# Altium project Array Supervisor Board.PrjPcb (part 3 of 3)
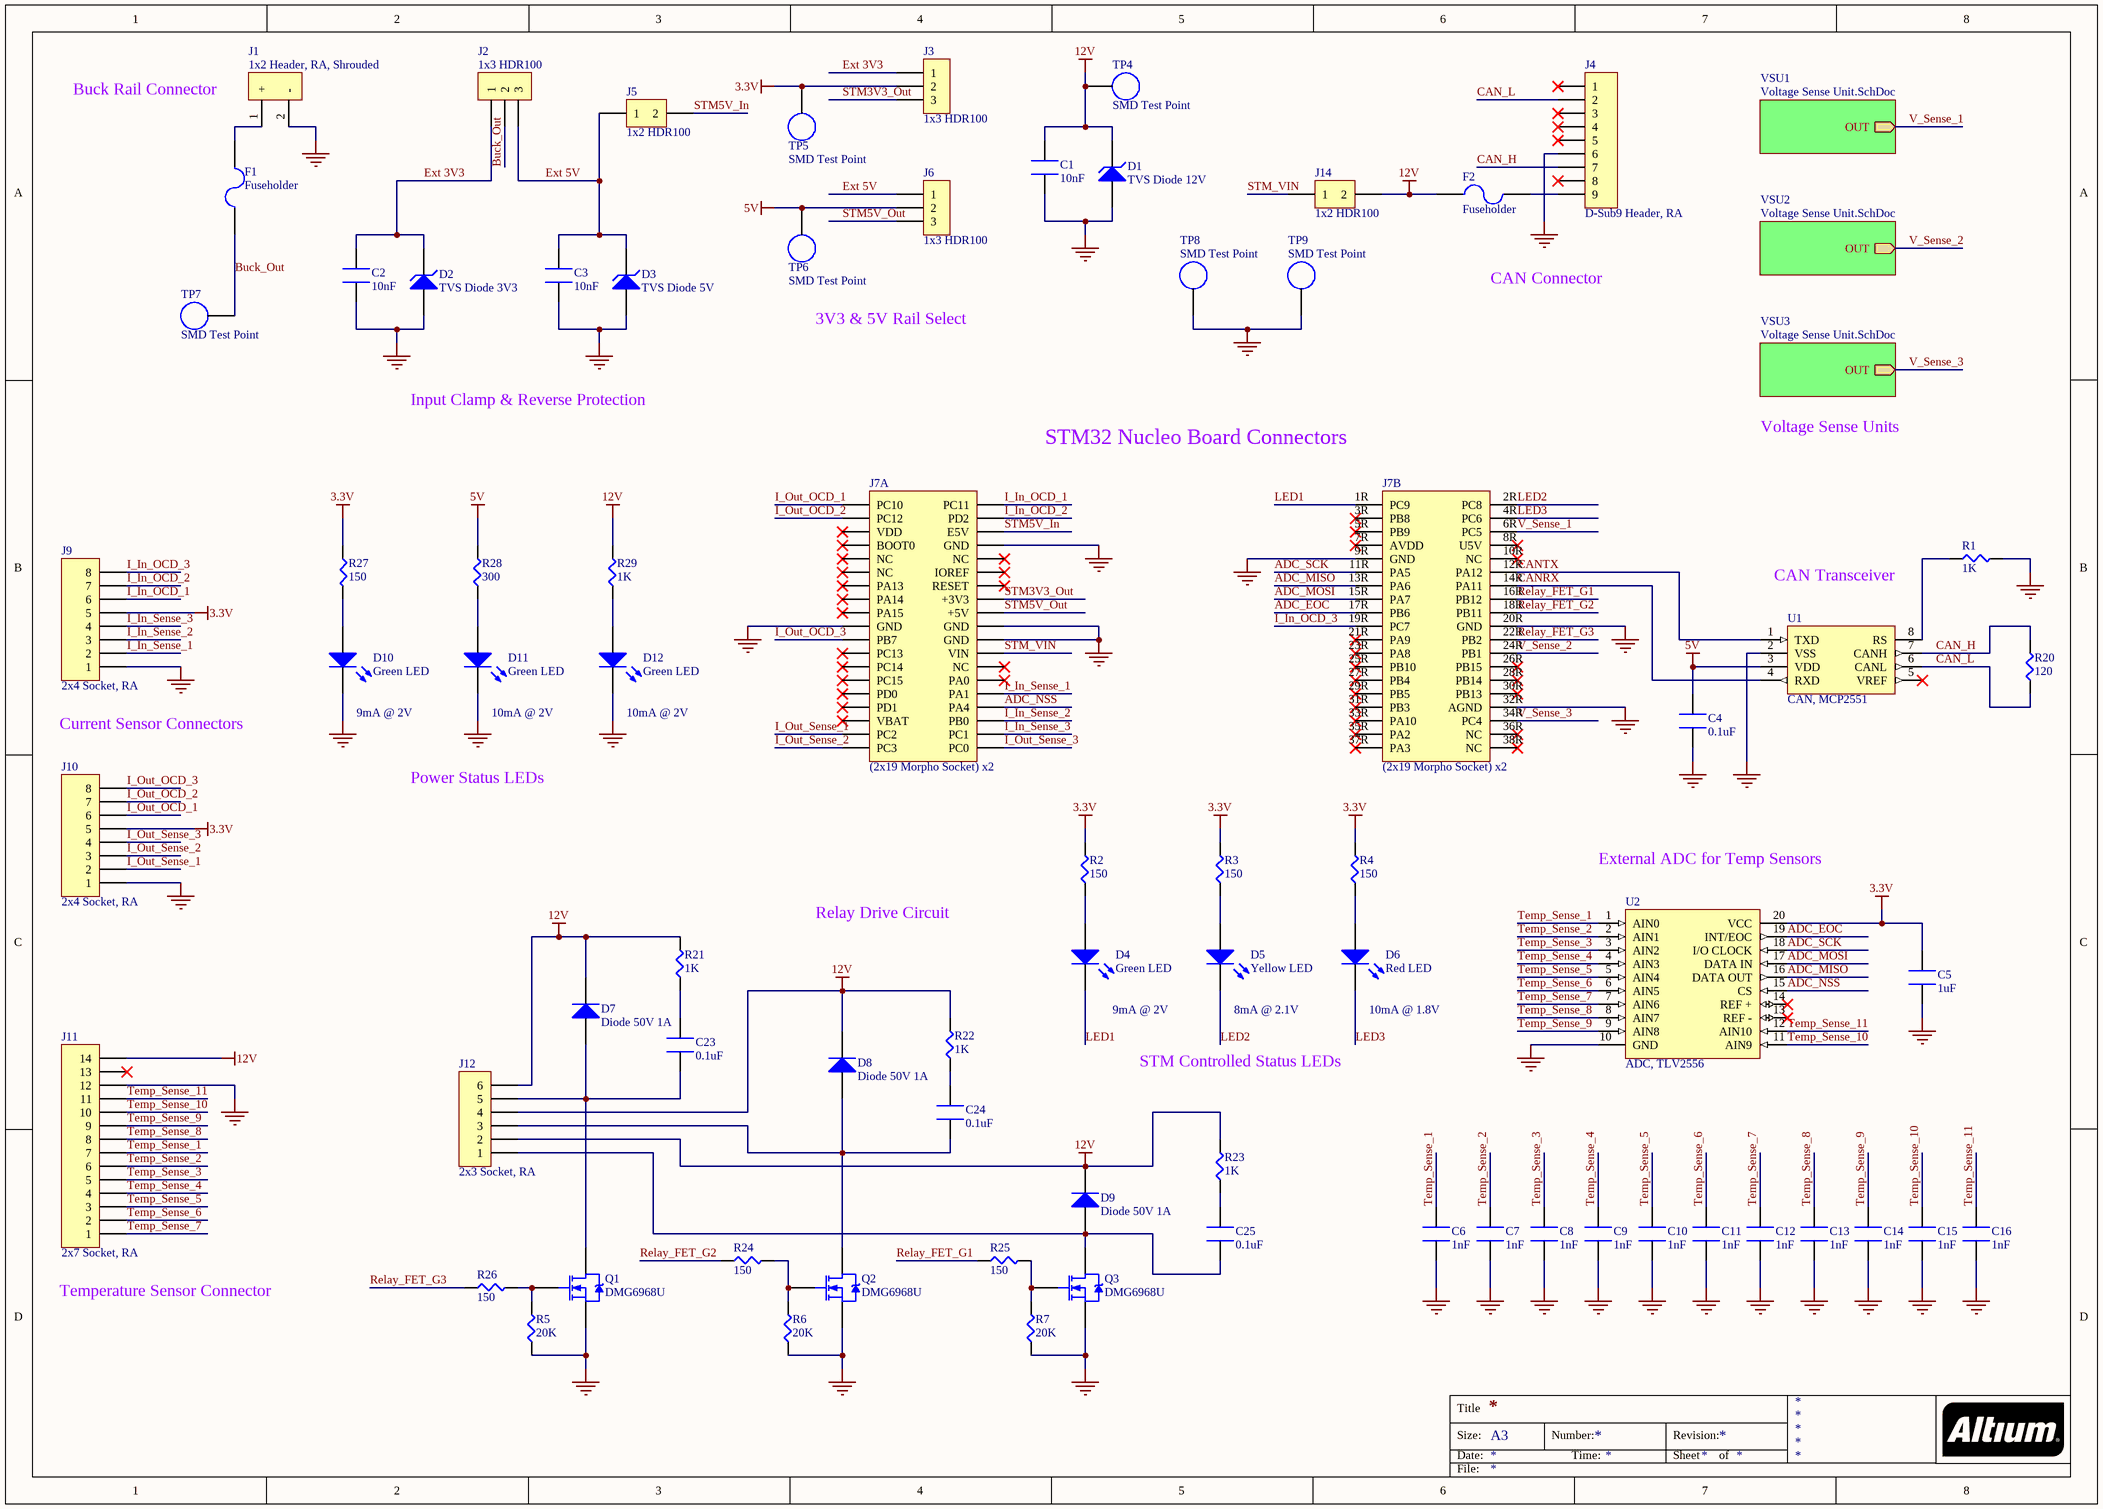
[diagram p3: ASB.SchDoc]

## Sheet ASB.SchDoc (continued)

### Library data of the parts (continued)
R20 = ERJ6ENF1200V: RES SMD 120 OHM 1% 1/8W 0805; Manufacturer: Panasonic; Resistance: 120R; Power Rating: 125mW; Voltage Rating: 150V; Temperature Coefficient: 100ppm/°C; Supplier 1: Digi-Key; Supplier Part Number 1: P120CCT-ND; Manufacturer Part Number: ERJ6ENF1200V; Stock 1: 309479; Pricing 1: 1 = 0.10000, 10 = 0.08100, 100 = 0.03110, 1000 = 0.01367, 2500 = 0.01181 (USD); RoHS: Yes; Mount: Surface Mount; Case/Package: 0805; Number of Pins: 2; Case Code (Imperial): 0805; Case Code (Metric): 2012; Contact Plating: Tin; Min Operating Temperature: -55°C; Max Operating Temperature: 155°C; Tolerance: 1%; Packaging: Tape and Reel; Package Quantity: 1; Termination: SMD/SMT; Composition: Thick Film; Number of Terminations: 2; Military Standard: Not; Max Power Dissipation: 125mW; Voltage Rating (DC): 150V; Features: Automotive AEC-Q200; Length: 2mm; Height: 0.6mm; Width: 1.2mm; Depth: 1.25mm; Radiation Hardening: No; REACH SVHC: No SVHC; Lead Free: Lead Free; ComponentLink1URL: https://datasheet.ciiva.com/11821/0900766b80f80784-11821533.pdf?src-supplier=RSComponents; ComponentLink1Description: https://datasheet.ciiva.com/11821/0900766b80f80784-11821533.pdf?src-supplier=RSComponents; ComponentLink2URL: https://datasheet.ciiva.com/22673/1678782-22673701.pdf?src-supplier=Element14; ComponentLink2Description: https://datasheet.ciiva.com/22673/1678782-22673701.pdf?src-supplier=Element14; ComponentLink3URL: https://datasheet.ciiva.com/15158/getdatasheetpartid-248620-15158999.pdf?src-supplier=Verical; ComponentLink3Description: https://datasheet.ciiva.com/15158/getdatasheetpartid-248620-15158999.pdf?src-supplier=Verical; ComponentLink4URL: https://datasheet.ciiva.com/16782/70260748-16782215.pdf?src-supplier=Allied+Electronics; ComponentLink4Description: https://datasheet.ciiva.com/16782/70260748-16782215.pdf?src-supplier=Allied+Electronics; ComponentLink5URL: https://datasheet.ciiva.com/24069/aoa0000ce2-24069192.pdf?src-supplier=Mouser; ComponentLink5Description: https://datasheet.ciiva.com/24069/aoa0000ce2-24069192.pdf?src-supplier=Mouser; ComponentLink6URL: https://datasheet.ciiva.com/46373/1678782-46373272.pdf?src-supplier=Element14; ComponentLink6Description: https://datasheet.ciiva.com/46373/1678782-46373272.pdf?src-supplier=Element14; ComponentLink7URL: https://datasheet.ciiva.com/46373/1678782-46373273.pdf?src-supplier=Element14; ComponentLink7Description: https://datasheet.ciiva.com/46373/1678782-46373273.pdf?src-supplier=Element14; ComponentLink8URL: https://datasheet.ciiva.com/17207/aoa0000ce2-17207722.pdf?src-supplier=Avnet+Europe; ComponentLink8Description: https://datasheet.ciiva.com/17207/aoa0000ce2-17207722.pdf?src-supplier=Avnet+Europe; ComponentLink9URL: https://datasheet.ciiva.com/6082/426256-6082139.pdf?src-supplier=Farnell; ComponentLink9Description: https://datasheet.ciiva.com/6082/426256-6082139.pdf?src-supplier=Farnell; ComponentLink10URL: https://datasheet.ciiva.com/22687/1678782-22687419.pdf?src-supplier=Element14; ComponentLink10Description: https://datasheet.ciiva.com/22687/1678782-22687419.pdf?src-supplier=Element14; ComponentLink11URL: https://datasheet.ciiva.com/7886/426256-7886749.pdf?src-supplier=Element14; ComponentLink11Description: https://datasheet.ciiva.com/7886/426256-7886749.pdf?src-supplier=Element14; ComponentLink12URL: https://datasheet.ciiva.com/9117/aoa0000ce2-9117405.pdf?src-supplier=Avnet; ComponentLink12Description: https://datasheet.ciiva.com/9117/aoa0000ce2-9117405.pdf?src-supplier=Avnet; ComponentLink13URL: https://datasheet.ciiva.com/16765/70260748-16765246.pdf?src-supplier=Allied+Electronics; ComponentLink13Description: https://datasheet.ciiva.com/16765/70260748-16765246.pdf?src-supplier=Allied+Electronics; ComponentLink14URL: https://datasheet.ciiva.com/16514/aoa0000ce2-16514031.pdf?src-supplier=Avnet+Asia; ComponentLink14Description: https://datasheet.ciiva.com/16514/aoa0000ce2-16514031.pdf?src-supplier=Avnet+Asia; Category: Resistors
R28 = ERJ-6ENF3000V: RES SMD 300 OHM 1% 1/8W 0805; Manufacturer: Panasonic; Power Rating: 125mW; Voltage Rating: 150V; Resistance: 300R; Temperature Coefficient: 100ppm/°C; Supplier 1: Digi-Key; Supplier Part Number 1: P300CCT-ND; Manufacturer Part Number: ERJ-6ENF3000V; Stock 1: 271248; Pricing 1: 1 = 0.10000, 10 = 0.08100, 100 = 0.03110, 1000 = 0.01367, 2500 = 0.01181 (USD); RoHS: Yes; Mount: Surface Mount; Case/Package: 0805; Case Code (Imperial): 0805; Case Code (Metric): 2012; Contact Plating: Tin; Min Operating Temperature: -55°C; Max Operating Temperature: 155°C; Tolerance: 1%; Packaging: Tape and Reel; Package Quantity: 1; Composition: Thick Film; Number of Terminations: 2; Military Standard: Not; Max Power Dissipation: 125mW; Voltage Rating (DC): 150V; Features: Automotive AEC-Q200; Termination: SMD/SMT; Length: 2mm; Height: 0.028inch; Width: 1.2mm; Depth: 1.25mm; Radiation Hardening: No; REACH SVHC: No SVHC; Lead Free: Lead Free; ComponentLink1URL: https://datasheet.ciiva.com/7711/1678782-7711061.pdf?src-supplier=Element14; ComponentLink1Description: https://datasheet.ciiva.com/7711/1678782-7711061.pdf?src-supplier=Element14; ComponentLink2URL: https://datasheet.ciiva.com/9183/aoa0000ce2-9183350.pdf?src-supplier=Avnet; ComponentLink2Description: https://datasheet.ciiva.com/9183/aoa0000ce2-9183350.pdf?src-supplier=Avnet; ComponentLink3URL: https://datasheet.ciiva.com/30132/aoa0000ce2-30132023.pdf?src-supplier=Onlinecomponents.com; ComponentLink3Description: https://datasheet.ciiva.com/30132/aoa0000ce2-30132023.pdf?src-supplier=Onlinecomponents.com; ComponentLink4URL: https://datasheet.ciiva.com/17206/aoa0000ce2-17206376.pdf?src-supplier=Avnet+Europe; ComponentLink4Description: https://datasheet.ciiva.com/17206/aoa0000ce2-17206376.pdf?src-supplier=Avnet+Europe; ComponentLink5URL: https://datasheet.ciiva.com/16512/aoa0000ce2-16512233.pdf?src-supplier=Avnet+Asia; ComponentLink5Description: https://datasheet.ciiva.com/16512/aoa0000ce2-16512233.pdf?src-supplier=Avnet+Asia; ComponentLink6URL: https://datasheet.ciiva.com/22681/1678782-22681692.pdf?src-supplier=Element14; ComponentLink6Description: https://datasheet.ciiva.com/22681/1678782-22681692.pdf?src-supplier=Element14; ComponentLink7URL: https://datasheet.ciiva.com/46373/1678782-46373662.pdf?src-supplier=Element14; ComponentLink7Description: https://datasheet.ciiva.com/46373/1678782-46373662.pdf?src-supplier=Element14; ComponentLink8URL: https://datasheet.ciiva.com/46373/1678782-46373663.pdf?src-supplier=Element14; ComponentLink8Description: https://datasheet.ciiva.com/46373/1678782-46373663.pdf?src-supplier=Element14; Category: Resistors
TP4-TP9 = 5019: Phosphor Bronze Contact Miniature Silver Plated Surface Mount Test Points; Manufacturer: Keystone Electronics; Supplier 1: Digi-Key; Supplier Part Number 1: 36-5019CT-ND; Manufacturer Part Number: 5019; Stock 1: 396064; Pricing 1: 1 = 0.35000, 10 = 0.33100, 25 = 0.28400, 50 = 0.24120, 100 = 0.23180, 250 = 0.20812, 500 = 0.19866 (USD); RoHS: Yes; Mount: PCB,Surface Mount; Number of Pins: 1; Contact Plating: Silver; Material: Bronze; Contact Material: Bronze; Packaging: Tape and Reel; Package Quantity: 1; Termination: SMD/SMT; Height: 0.09inch; REACH SVHC: No SVHC; Lead Free: Lead Free; ComponentLink1URL: http://www.keyelco.com/userAssets/file/M60-2p61.pdf?src-supplier=Digi-Key; ComponentLink1Description: http://www.keyelco.com/userAssets/file/M60-2p61.pdf?src-supplier=Digi-Key; ComponentLink2URL: https://www.alliedelec.com/m/d/7cde97af424e5e26d7fd34350071af05.pdf?src-supplier=Allied+Electronics; ComponentLink2Description: https://www.alliedelec.com/m/d/7cde97af424e5e26d7fd34350071af05.pdf?src-supplier=Allied+Electronics; ComponentLink3URL: http://www.keyelco.com/userAssets/file/M60-2p61.pdf?src-supplier=Future+Electronics; ComponentLink3Description: http://www.keyelco.com/userAssets/file/M60-2p61.pdf?src-supplier=Future+Electronics; Category: Test and Measurement; ComponentLink4Description: Digikey; ComponentLink4URL: https://www.digikey.com/product-detail/en/keystone-electronics/5019/36-5019CT-ND/3907344
U1 = MCP2551-E/SN: IC, TRANSCEIVER, CAN, SMD, 8SOIC; Manufacturer: Microchip; Interface: CAN,Serial; Operating Supply Voltage: 5V; Data Rate: 1Mbps; Max Supply Voltage: 5.5V; Min Supply Voltage: 4.5V; Nominal Supply Current: 75mA; Number of Receive Buffers: 1; Supplier 1: Digi-Key; Supplier Part Number 1: MCP2551-E/SN-ND; Manufacturer Part Number: MCP2551-E/SN; Stock 1: 9215; Pricing 1: 1 = 1.22000, 25 = 1.00960, 100 = 0.91670 (USD); RoHS: Yes; Mount: Surface Mount; Case/Package: SOIC; Number of Pins: 8; Contact Plating: Matte,Tin; Min Operating Temperature: -40°C; Max Operating Temperature: 125°C; Package Quantity: 100; Packaging: Rail/Tube; Number of Transmit Buffers: 1; Max Supply Current: 75mA; Number of Transceivers: 1; Number of Drivers: 1; Number of Receivers: 1; Logic Function: Transceiver; Length: 0.192inch; Height: 0.059inch; Width: 0.154inch; Radiation Hardening: No; REACH SVHC: No SVHC; Lead Free: Lead Free; ComponentLink1URL: http://www.microchip.com/mymicrochip/filehandler.aspx?ddocname=en011797&src-supplier=Future+Electronics; ComponentLink1Description: http://www.microchip.com/mymicrochip/filehandler.aspx?ddocname=en011797&src-supplier=Future+Electronics; ComponentLink2URL: http://www.microchip.com/mymicrochip/filehandler.aspx?ddocname=en023833&src-supplier=Digi-Key; ComponentLink2Description: http://www.microchip.com/mymicrochip/filehandler.aspx?ddocname=en023833&src-supplier=Digi-Key; ComponentLink3URL: http://www.mouser.com/ds/2/268/20001667G-1115479.pdf?src-supplier=Mouser; ComponentLink3Description: http://www.mouser.com/ds/2/268/20001667G-1115479.pdf?src-supplier=Mouser; ComponentLink4URL: https://www.distrelec.biz/Web/Downloads/_t/ds/mcp2551_eng_tds.pdf?mime=application%2Fpdf&src-supplier=Distrelec; ComponentLink4Description: https://www.distrelec.biz/Web/Downloads/_t/ds/mcp2551_eng_tds.pdf?mime=application%2Fpdf&src-supplier=Distrelec; ComponentLink5URL: http://www.farnell.com/datasheets/2299423.pdf?src-supplier=Element14; ComponentLink5Description: http://www.farnell.com/datasheets/2299423.pdf?src-supplier=Element14; Category: Integrated Circuits (ICs); ComponentLink6Description: Digikey; ComponentLink6URL: https://www.digikey.ca/product-detail/en/microchip-technology/MCP2551-E-SN/MCP2551-E-SN-ND/509446
U2 = TLV2556IDW: IC SERIAL ADC 12-BIT 5V 20-SOIC; Manufacturer: Texas Instruments; Nominal Supply Current: 3mA; Min Supply Voltage: 2.7V; Max Supply Voltage: 5.5V; Number of Channels: 11; Max Power Dissipation: 2.43mW; Interface: SPI; Number of Bits: 12; Sampling Rate: 200KS/s; Number of Converters: 1; Resolution: 12b; Polarity: Unipolar; Differential Nonlinearity: 1LSB; Supply Type: Single; Supplier 1: Digi-Key; Supplier Part Number 1: 296-12502-5-ND; Manufacturer Part Number: TLV2556IDW; Stock 1: 5611; Pricing 1: 1 = 10.04000, 10 = 9.06900, 25 = 8.64680, 100 = 7.50800, 500 = 6.53790, 1000 = 5.69430 (USD); RoHS: Yes; Case/Package: SOIC; Number of Pins: 20; Min Operating Temperature: -40°C; Max Operating Temperature: 85°C; Package Quantity: 25; Packaging: Rail/Tube; Number of Elements: 1; Number of A/D Converters: 1; Number of Analog Inputs: 11; Conversion Rate: 200KS/s; Integral Nonlinearity (INL): 1LSB; Number of Inputs: 11; Max Supply Voltage (DC): 5.5V; Min Supply Voltage (DC): 2.7V; Power Consumption: 2.43mW; REACH SVHC: No SVHC; Lead Free: Lead Free; ComponentLink1URL: http://www.ti.com/lit/ds/symlink/tlv2556.pdf?src-supplier=Digi-Key; ComponentLink1Description: http://www.ti.com/lit/ds/symlink/tlv2556.pdf?src-supplier=Digi-Key; ComponentLink2URL: http://www.ti.com/general/docs/lit/getliterature.tsp?genericPartNumber=TLV2556&&fileType=pdf&src-supplier=Avnet; ComponentLink2Description: http://www.ti.com/general/docs/lit/getliterature.tsp?genericPartNumber=TLV2556&&fileType=pdf&src-supplier=Avnet; ComponentLink3URL: http://datasheet.iiic.cc/texas_instruments/TLV2556IDW.pdf?src-supplier=IIIC; ComponentLink3Description: http://datasheet.iiic.cc/texas_instruments/TLV2556IDW.pdf?src-supplier=IIIC; ComponentLink4URL: http://www.produktinfo.conrad.com/datenblaetter/1100000-1199999/001186451-da-01-en-IC_SERIAL_ADC_12__TLV2556IDW_SOIC_20_TID.pdf?src-supplier=Conrad; ComponentLink4Description: http://www.produktinfo.conrad.com/datenblaetter/1100000-1199999/001186451-da-01-en-IC_SERIAL_ADC_12__TLV2556IDW_SOIC_20_TID.pdf?src-supplier=Conrad; Category: Integrated Circuits (ICs)

## Sheet Voltage Sense Unit.SchDoc
size A3
Used 3 times, as channels VSU1, VSU2, VSU3. Parts and nets are listed once, with the designators drawn on the sheet.
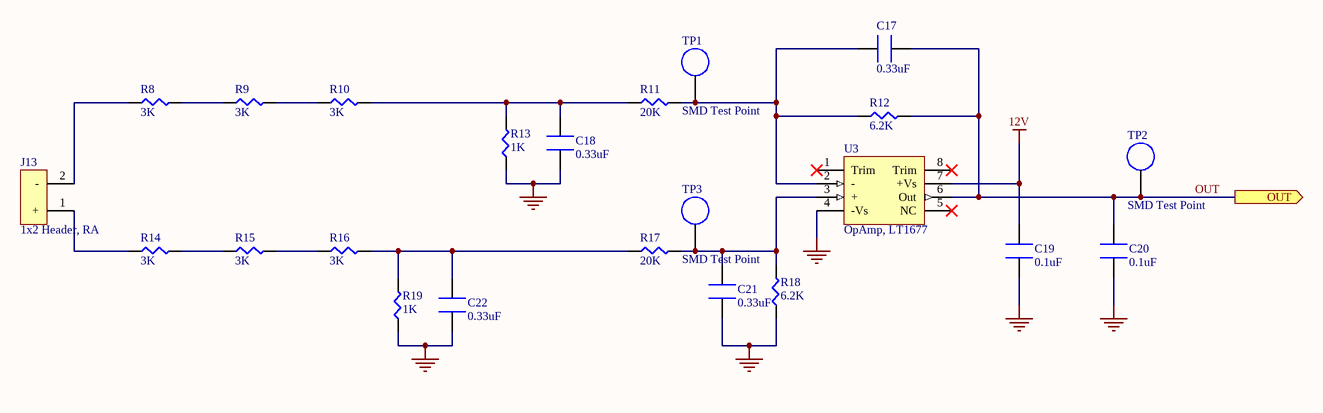
[diagram p1: Voltage Sense Unit.SchDoc]

### Parts
C17  0.33uF  [C0805]
C18  0.33uF  [C0805]
C19  0.1uF  [C0805]
C20  0.1uF  [C0805]
C21  0.33uF  [C0805]
C22  0.33uF  [C0805]
J13  1x2 Header, RA  [Right Angle Header 43650-0205(Primary)]
R8  3K  [R0805]
R9  3K  [R0805]
R10  3K  [R0805]
R11  20K  [R0805]
R12  6.2K  [R0805]
R13  1K  [R0805]
R14  3K  [R0805]
R15  3K  [R0805]
R16  3K  [R0805]
R17  20K  [R0805]
R18  6.2K  [R0805]
R19  1K  [R0805]
TP1  SMD Test Point  [5019 Keystone SMT Test Point]
TP2  SMD Test Point  [5019 Keystone SMT Test Point]
TP3  SMD Test Point  [5019 Keystone SMT Test Point]
U3  OpAmp, LT1677  [LT1677IS8#TRPBF]

### Ports
OUT (out)

### Nets
12V: C19.2 U3.7(+Vs)
GND: C18.1 C19.1 C20.1 C21.1 C22.1 R13.1 R18.1 R19.1 U3.4(-Vs)
OUT: C17.2 C20.2 R12.2 TP2.1 U3.6(Out) ; port OUT
NetC17_1: C17.1 R11.2 R12.1 TP1.1 U3.2(-)
NetC18_2: C18.2 R10.2 R11.1 R13.2
NetC21_2: C21.2 R17.2 R18.2 TP3.1 U3.3(+)
NetC22_2: C22.2 R16.2 R17.1 R19.2
NetJ13_1: J13.1(+) R14.1
NetJ13_2: J13.2(-) R8.1
NetR8_2: R8.2 R9.1
NetR9_2: R9.2 R10.1
NetR14_2: R14.2 R15.1
NetR15_2: R15.2 R16.1

Not connected (* = marked no-connect by the designer): U3 1(Trim)* 5(NC)* 8(Trim)*

### Channels
VSU1: designators end in _VSU1; ports OUT=OUT
VSU2: designators end in _VSU2; ports OUT=OUT
VSU3: designators end in _VSU3; ports OUT=OUT

### Notes on the sheet
- Title
- Size:
- Date:
- A3
- Number:
- Time:
- Revision:
- Sheet
- of
- File:

### Library data of the parts
C17 C18 C21 C22 = CL21B334KBFVPNE: CAP CER 0.33UF 50V X7R 0805; Manufacturer: Samsung; Capacitance: 330nF; Tolerance: 10%; Supplier 1: Digi-Key; Supplier Part Number 1: 1276-6813-1-ND; Manufacturer Part Number: CL21B334KBFVPNE; Stock 1: 190572; Pricing 1: 1 = 0.22000, 10 = 0.15200, 100 = 0.07690, 500 = 0.05260, 1000 = 0.04653 (USD); RoHS: Yes; Mount: Surface Mount; Case/Package: 0805; Case Code (Metric): 2012; Case Code (Imperial): 0805; Min Operating Temperature: -55°C; Max Operating Temperature: 125°C; Packaging: Tape and Reel; Voltage Rating: 50V; Features: Soft Termination; Length: 0.079inch; Width: 0.049inch; Thickness: 0.053inch; Ratings: AEC-Q200; Category: Capacitors
C19 C20 = CL21B104KBCWPNC: CAP CER 0.1UF 50V X7R 0805; Manufacturer: Samsung; Capacitance: 100nF; Tolerance: 10%; Supplier 1: Digi-Key; Supplier Part Number 1: 1276-6557-1-ND; Manufacturer Part Number: CL21B104KBCWPNC; Stock 1: 6545; Pricing 1: 1 = 0.10000, 10 = 0.06700, 100 = 0.02990, 500 = 0.02138, 1000 = 0.01680 (USD); RoHS: Yes; Mount: Surface Mount; Case/Package: 0805; Case Code (Metric): 2012; Case Code (Imperial): 0805; Min Operating Temperature: -55°C; Max Operating Temperature: 125°C; Packaging: Tape and Reel; Voltage Rating: 50V; Features: Soft Termination; Length: 0.079inch; Width: 0.049inch; Thickness: 0.053inch; Ratings: AEC-Q200; Category: Capacitors
J13 = 43650-0205: HEADER, RIGHT ANGLE, 2WAY; Manufacturer: Molex; Number of Positions: 2; Voltage Rating: 600V; Current Rating: 5A; Gender: Male; Pitch: 3mm; Glow Wire Compliant: Compliant; Supplier 1: Digi-Key; Supplier Part Number 1: WM17581-ND; Manufacturer Part Number: 43650-0205; Stock 1: 2695; Pricing 1: 1 = 1.44000, 10 = 1.30500, 100 = 1.11870, 500 = 0.93222, 3927 = 0.74578, 7854 = 0.70849, 11781 = 0.69251 (USD); RoHS: Yes; Contact Material: Brass; Contact Plating: Gold; Housing Material: Thermoplastic; Number of Rows: 1; Packaging: Tray; Termination: Through Hole; Number of Contacts: 2; Orientation: Right Angle; Package Quantity: 3927; Number of Circuits: 2; Halogen Free: Low Halogen; ComponentLink1URL: http://www.farnell.com/cad/153635.pdf?src-supplier=Element14; ComponentLink1Description: http://www.farnell.com/cad/153635.pdf?src-supplier=Element14; ComponentLink2URL: http://www.molex.com/webdocs/datasheets/pdf/en-us/0436500205_PCB_HEADERS.pdf?src-supplier=Avnet; ComponentLink2Description: http://www.molex.com/webdocs/datasheets/pdf/en-us/0436500205_PCB_HEADERS.pdf?src-supplier=Avnet; ComponentLink3URL: http://www.molex.com/webdocs/datasheets/pdf/en-us/0436500205_PCB_HEADERS.pdf?src-supplier=Avnet+Europe; ComponentLink3Description: http://www.molex.com/webdocs/datasheets/pdf/en-us/0436500205_PCB_HEADERS.pdf?src-supplier=Avnet+Europe; ComponentLink4URL: http://www.mouser.com/ds/2/276/0436500205_PCB_HEADERS-148686.pdf?src-supplier=Mouser; ComponentLink4Description: http://www.mouser.com/ds/2/276/0436500205_PCB_HEADERS-148686.pdf?src-supplier=Mouser; Category: Connectors; ComponentLink5Description: Digikey; ComponentLink5URL: https://www.digikey.com/products/en?WT.z_cid=sp_900_0310_buynow&keywords=436500205
R8-R10 R14-R16 = ERJ6ENF3001V: RES SMD 3K OHM 1% 1/8W 0805; Manufacturer: Panasonic; Resistance: 3kR; Power Rating: 125mW; Voltage Rating: 150V; Temperature Coefficient: 100ppm/°C; Supplier 1: Digi-Key; Supplier Part Number 1: P3.0KCCT-ND; Manufacturer Part Number: ERJ6ENF3001V; Stock 1: 514759; Pricing 1: 1 = 0.10000, 10 = 0.08100, 100 = 0.03110, 1000 = 0.01367, 2500 = 0.01181 (USD); RoHS: Yes; Mount: Surface Mount; Case/Package: 0805; Weight: 0.000194oz; Case Code (Metric): 2012; Case Code (Imperial): 0805; Contact Plating: Tin; Min Operating Temperature: -55°C; Max Operating Temperature: 155°C; Tolerance: 1%; Packaging: Tape and Reel; Package Quantity: 1; Composition: Thick Film; Number of Terminations: 2; Termination: SMD/SMT; Military Standard: Not; Max Power Dissipation: 125mW; Voltage Rating (DC): 150V; Features: Automotive AEC-Q200; Length: 2mm; Height: 0.6mm; Width: 0.049inch; Depth: 1.25mm; Radiation Hardening: No; REACH SVHC: No SVHC; ComponentLink1URL: https://datasheet.ciiva.com/11821/0900766b80f80784-11821622.pdf?src-supplier=RSComponents; ComponentLink1Description: https://datasheet.ciiva.com/11821/0900766b80f80784-11821622.pdf?src-supplier=RSComponents; ComponentLink2URL: https://datasheet.ciiva.com/30198/aoa0000ce2-30198229.pdf?src-supplier=Onlinecomponents.com; ComponentLink2Description: https://datasheet.ciiva.com/30198/aoa0000ce2-30198229.pdf?src-supplier=Onlinecomponents.com; ComponentLink3URL: https://datasheet.ciiva.com/17213/aoa0000ce2-17213863.pdf?src-supplier=Avnet+Europe; ComponentLink3Description: https://datasheet.ciiva.com/17213/aoa0000ce2-17213863.pdf?src-supplier=Avnet+Europe; ComponentLink4URL: https://datasheet.ciiva.com/24165/aoa0000ce2-24165784.pdf?src-supplier=Mouser; ComponentLink4Description: https://datasheet.ciiva.com/24165/aoa0000ce2-24165784.pdf?src-supplier=Mouser; ComponentLink5URL: https://datasheet.ciiva.com/9117/aoa0000ce2-9117481.pdf?src-supplier=Avnet; ComponentLink5Description: https://datasheet.ciiva.com/9117/aoa0000ce2-9117481.pdf?src-supplier=Avnet; ComponentLink6URL: https://datasheet.ciiva.com/28691/1678782-28691979.pdf?src-supplier=Element14; ComponentLink6Description: https://datasheet.ciiva.com/28691/1678782-28691979.pdf?src-supplier=Element14; ComponentLink7URL: https://datasheet.ciiva.com/46386/426256-46386363.pdf?src-supplier=Element14; ComponentLink7Description: https://datasheet.ciiva.com/46386/426256-46386363.pdf?src-supplier=Element14; ComponentLink8URL: https://datasheet.ciiva.com/16758/70260748-16758588.pdf?src-supplier=Allied+Electronics; ComponentLink8Description: https://datasheet.ciiva.com/16758/70260748-16758588.pdf?src-supplier=Allied+Electronics; ComponentLink9URL: https://datasheet.ciiva.com/6137/426256-6137581.pdf?src-supplier=Farnell; ComponentLink9Description: https://datasheet.ciiva.com/6137/426256-6137581.pdf?src-supplier=Farnell; ComponentLink10URL: https://datasheet.ciiva.com/46373/426256-46373965.pdf?src-supplier=Element14; ComponentLink10Description: https://datasheet.ciiva.com/46373/426256-46373965.pdf?src-supplier=Element14; ComponentLink11URL: https://datasheet.ciiva.com/28565/1678782-28565182.pdf?src-supplier=Element14; ComponentLink11Description: https://datasheet.ciiva.com/28565/1678782-28565182.pdf?src-supplier=Element14; ComponentLink12URL: https://datasheet.ciiva.com/16762/70260748-16762943.pdf?src-supplier=Allied+Electronics; ComponentLink12Description: https://datasheet.ciiva.com/16762/70260748-16762943.pdf?src-supplier=Allied+Electronics; Category: Resistors
R11 R17 = ERJ6ENF2002V: RES SMD 20K OHM 1% 1/8W 0805; Manufacturer: Panasonic; Resistance: 20kR; Power Rating: 125mW; Voltage Rating: 150V; Temperature Coefficient: 100ppm/°C; Supplier 1: Digi-Key; Supplier Part Number 1: P20.0KCCT-ND; Manufacturer Part Number: ERJ6ENF2002V; Stock 1: 1039498; Pricing 1: 1 = 0.10000, 10 = 0.08100, 100 = 0.03110, 1000 = 0.01367, 2500 = 0.01181 (USD); RoHS: Yes; Mount: Surface Mount; Case/Package: 0805; Case Code (Metric): 2012; Case Code (Imperial): 0805; Contact Plating: Tin; Min Operating Temperature: -55°C; Max Operating Temperature: 155°C; Tolerance: 1%; Packaging: Tape and Reel; Package Quantity: 1; Composition: Thick Film; Number of Terminations: 2; Military Standard: Not; Termination: SMD/SMT; Max Power Dissipation: 125mW; Voltage Rating (DC): 150V; Features: Automotive AEC-Q200; Working Voltage: 150V; Length: 2mm; Height: 0.6mm; Width: 0.049inch; Depth: 1.25mm; Radiation Hardening: No; REACH SVHC: No SVHC; Lead Free: Lead Free; ComponentLink1URL: https://datasheet.ciiva.com/11821/0900766b80f80784-11821565.pdf?src-supplier=RSComponents; ComponentLink1Description: https://datasheet.ciiva.com/11821/0900766b80f80784-11821565.pdf?src-supplier=RSComponents; ComponentLink2URL: https://datasheet.ciiva.com/30072/aoa0000ce2-30072453.pdf?src-supplier=Onlinecomponents.com; ComponentLink2Description: https://datasheet.ciiva.com/30072/aoa0000ce2-30072453.pdf?src-supplier=Onlinecomponents.com; ComponentLink3URL: https://datasheet.ciiva.com/43460/426256-43460054.pdf?src-supplier=Farnell; ComponentLink3Description: https://datasheet.ciiva.com/43460/426256-43460054.pdf?src-supplier=Farnell; ComponentLink4URL: https://datasheet.ciiva.com/16786/70260748-16786968.pdf?src-supplier=Allied+Electronics; ComponentLink4Description: https://datasheet.ciiva.com/16786/70260748-16786968.pdf?src-supplier=Allied+Electronics; ComponentLink5URL: https://datasheet.ciiva.com/9192/aoa0000ce2-9192153.pdf?src-supplier=Avnet; ComponentLink5Description: https://datasheet.ciiva.com/9192/aoa0000ce2-9192153.pdf?src-supplier=Avnet; ComponentLink6URL: https://datasheet.ciiva.com/48531/aoa0000ce2-48531785.pdf?src-supplier=Avnet; ComponentLink6Description: https://datasheet.ciiva.com/48531/aoa0000ce2-48531785.pdf?src-supplier=Avnet; ComponentLink7URL: https://datasheet.ciiva.com/15159/getdatasheetpartid-249649-15159066.pdf?src-supplier=Verical; ComponentLink7Description: https://datasheet.ciiva.com/15159/getdatasheetpartid-249649-15159066.pdf?src-supplier=Verical; ComponentLink8URL: https://datasheet.ciiva.com/17211/aoa0000ce2-17211115.pdf?src-supplier=Avnet+Europe; ComponentLink8Description: https://datasheet.ciiva.com/17211/aoa0000ce2-17211115.pdf?src-supplier=Avnet+Europe; ComponentLink9URL: https://datasheet.ciiva.com/46389/426256-46389083.pdf?src-supplier=Element14; ComponentLink9Description: https://datasheet.ciiva.com/46389/426256-46389083.pdf?src-supplier=Element14; ComponentLink10URL: https://datasheet.ciiva.com/46377/426256-46377356.pdf?src-supplier=Element14; ComponentLink10Description: https://datasheet.ciiva.com/46377/426256-46377356.pdf?src-supplier=Element14; ComponentLink11URL: https://datasheet.ciiva.com/24025/aoa0000ce2-24025709.pdf?src-supplier=Mouser; ComponentLink11Description: https://datasheet.ciiva.com/24025/aoa0000ce2-24025709.pdf?src-supplier=Mouser; ComponentLink12URL: https://datasheet.ciiva.com/28688/1678782-28688637.pdf?src-supplier=Element14; ComponentLink12Description: https://datasheet.ciiva.com/28688/1678782-28688637.pdf?src-supplier=Element14; ComponentLink13URL: https://datasheet.ciiva.com/16512/aoa0000ce2-16512158.pdf?src-supplier=Avnet+Asia; ComponentLink13Description: https://datasheet.ciiva.com/16512/aoa0000ce2-16512158.pdf?src-supplier=Avnet+Asia; ComponentLink14URL: https://datasheet.ciiva.com/22749/1678782-22749662.pdf?src-supplier=Element14; ComponentLink14Description: https://datasheet.ciiva.com/22749/1678782-22749662.pdf?src-supplier=Element14; Category: Resistors
R12 R18 = ERJ6ENF6201V: RES SMD 6.2K OHM 1% 1/8W 0805; Manufacturer: Panasonic; Resistance: 6.2kR; Power Rating: 125mW; Voltage Rating: 150V; Temperature Coefficient: 100ppm/°C; Supplier 1: Digi-Key; Supplier Part Number 1: P6.20KCCT-ND; Manufacturer Part Number: ERJ6ENF6201V; Stock 1: 65881; Pricing 1: 1 = 0.10000, 10 = 0.08100, 100 = 0.03110, 1000 = 0.01367, 2500 = 0.01181 (USD); RoHS: Yes; Mount: Surface Mount; Case/Package: 0805; Weight: 0.000194oz; Case Code (Imperial): 0805; Case Code (Metric): 2012; Contact Plating: Tin; Min Operating Temperature: -55°C; Max Operating Temperature: 155°C; Tolerance: 1%; Packaging: Tape and Reel; Package Quantity: 1; Composition: Thick Film; Termination: SMD/SMT; Number of Terminations: 2; Military Standard: Not; Max Power Dissipation: 125mW; Voltage Rating (DC): 150V; Features: Automotive AEC-Q200; Length: 2mm; Height: 0.6mm; Width: 1.2mm; Depth: 1.25mm; Radiation Hardening: No; REACH SVHC: No SVHC; ComponentLink1URL: https://datasheet.ciiva.com/11821/0900766b80f80784-11821682.pdf?src-supplier=RSComponents; ComponentLink1Description: https://datasheet.ciiva.com/11821/0900766b80f80784-11821682.pdf?src-supplier=RSComponents; ComponentLink2URL: https://datasheet.ciiva.com/46373/1678782-46373789.pdf?src-supplier=Element14; ComponentLink2Description: https://datasheet.ciiva.com/46373/1678782-46373789.pdf?src-supplier=Element14; ComponentLink3URL: https://datasheet.ciiva.com/46373/1678782-46373790.pdf?src-supplier=Element14; ComponentLink3Description: https://datasheet.ciiva.com/46373/1678782-46373790.pdf?src-supplier=Element14; Category: Resistors
R13 R19 = ERJ6ENF1001V: RES SMD 1K OHM 1% 1/8W 0805; Manufacturer: Panasonic; Resistance: 1kR; Power Rating: 125mW; Temperature Coefficient: 100ppm/°C; Voltage Rating (DC): 150V; Supplier 1: Digi-Key; Supplier Part Number 1: P1.00KCCT-ND; Manufacturer Part Number: ERJ6ENF1001V; Stock 1: 946321; Pricing 1: 1 = 0.100000, 10 = 0.081000, 100 = 0.031100, 1000 = 0.013670, 2500 = 0.011810 (USD); RoHS: Yes; Mount: Surface Mount; Case/Package: 0805; Number of Pins: 2; Case Code (Metric): 2012; Case Code (Imperial): 0805; Contact Plating: Tin; Min Operating Temperature: -55°C; Max Operating Temperature: 155°C; Tolerance: 1%; Packaging: Tape and Reel; Number of Terminations: 2; Package Quantity: 1; Voltage Rating: 150V; Composition: Thick Film; Termination: SMD/SMT; Military Standard: Not; Max Power Dissipation: 125mW; Features: Automotive AEC-Q200; Length: 2mm; Height: 0.6mm; Width: 0.049inch; Depth: 1.25mm; Radiation Hardening: No; REACH SVHC: No SVHC; Lead Free: Lead Free; ComponentLink1URL: https://datasheet.ciiva.com/34303/1988962-34303619.pdf?src-supplier=Jameco; ComponentLink1Description: https://datasheet.ciiva.com/34303/1988962-34303619.pdf?src-supplier=Jameco; ComponentLink2URL: https://datasheet.ciiva.com/11808/0900766b80f80784-11808500.pdf?src-supplier=RSComponents; ComponentLink2Description: https://datasheet.ciiva.com/11808/0900766b80f80784-11808500.pdf?src-supplier=RSComponents; ComponentLink3URL: https://datasheet.ciiva.com/28532/426256-28532134.pdf?src-supplier=Element14; ComponentLink3Description: https://datasheet.ciiva.com/28532/426256-28532134.pdf?src-supplier=Element14; ComponentLink4URL: https://datasheet.ciiva.com/30051/aoa0000ce2-30051974.pdf?src-supplier=Onlinecomponents.com; ComponentLink4Description: https://datasheet.ciiva.com/30051/aoa0000ce2-30051974.pdf?src-supplier=Onlinecomponents.com; ComponentLink5URL: https://datasheet.ciiva.com/16774/70260748-16774249.pdf?src-supplier=Allied+Electronics; ComponentLink5Description: https://datasheet.ciiva.com/16774/70260748-16774249.pdf?src-supplier=Allied+Electronics; ComponentLink6URL: https://datasheet.ciiva.com/46373/1678782-46373337.pdf?src-supplier=Element14; ComponentLink6Description: https://datasheet.ciiva.com/46373/1678782-46373337.pdf?src-supplier=Element14; ComponentLink7URL: https://datasheet.ciiva.com/46373/1678782-46373338.pdf?src-supplier=Element14; ComponentLink7Description: https://datasheet.ciiva.com/46373/1678782-46373338.pdf?src-supplier=Element14; ComponentLink8URL: https://datasheet.ciiva.com/48532/aoa0000ce2-48532156.pdf?src-supplier=Avnet; ComponentLink8Description: https://datasheet.ciiva.com/48532/aoa0000ce2-48532156.pdf?src-supplier=Avnet; ComponentLink9URL: https://datasheet.ciiva.com/7942/426256-7942429.pdf?src-supplier=Element14; ComponentLink9Description: https://datasheet.ciiva.com/7942/426256-7942429.pdf?src-supplier=Element14; ComponentLink10URL: https://datasheet.ciiva.com/16199/aoa0000ce2-16199262.pdf?src-supplier=Future+Electronics; ComponentLink10Description: https://datasheet.ciiva.com/16199/aoa0000ce2-16199262.pdf?src-supplier=Future+Electronics; ComponentLink11URL: https://datasheet.ciiva.com/9117/aoa0000ce2-9117391.pdf?src-supplier=Avnet; ComponentLink11Description: https://datasheet.ciiva.com/9117/aoa0000ce2-9117391.pdf?src-supplier=Avnet; ComponentLink12URL: https://datasheet.ciiva.com/16523/aoa0000ce2-16523855.pdf?src-supplier=Avnet+Asia; ComponentLink12Description: https://datasheet.ciiva.com/16523/aoa0000ce2-16523855.pdf?src-supplier=Avnet+Asia; Category: Resistors
TP1-TP3 = 5019: as TP4 on sheet ASB; Supplier 1: Digi-Key; Supplier Part Number 1: 36-5019CT-ND; Manufacturer Part Number: 5019; Stock 1: 396064; Pricing 1: 1 = 0.35000, 10 = 0.33100, 25 = 0.28400, 50 = 0.24120, 100 = 0.23180, 250 = 0.20812, 500 = 0.19866 (USD); RoHS: Yes; Mount: PCB,Surface Mount; Number of Pins: 1; Contact Plating: Silver; Material: Bronze; Contact Material: Bronze; Packaging: Tape and Reel; Package Quantity: 1; Termination: SMD/SMT; Height: 0.09inch; REACH SVHC: No SVHC; Lead Free: Lead Free; ComponentLink1URL: http://www.keyelco.com/userAssets/file/M60-2p61.pdf?src-supplier=Digi-Key; ComponentLink1Description: http://www.keyelco.com/userAssets/file/M60-2p61.pdf?src-supplier=Digi-Key; ComponentLink2URL: https://www.alliedelec.com/m/d/7cde97af424e5e26d7fd34350071af05.pdf?src-supplier=Allied+Electronics; ComponentLink2Description: https://www.alliedelec.com/m/d/7cde97af424e5e26d7fd34350071af05.pdf?src-supplier=Allied+Electronics; ComponentLink3URL: http://www.keyelco.com/userAssets/file/M60-2p61.pdf?src-supplier=Future+Electronics; ComponentLink3Description: http://www.keyelco.com/userAssets/file/M60-2p61.pdf?src-supplier=Future+Electronics; Category: Test and Measurement; ComponentLink4Description: Digikey; ComponentLink4URL: https://www.digikey.com/product-detail/en/keystone-electronics/5019/36-5019CT-ND/3907344
U3 = LT1677IS8#TRPBF: IC OPAMP GP 7.2MHZ RRO 8SO; Manufacturer: Analog Devices / Linear Technology; Common Mode Rejection Ratio: 60dB; Min Dual Supply Voltage: 1.5V; Max Dual Supply Voltage: 18V; Slew Rate: 2.5V/µs; Max Supply Voltage: 44V; Min Supply Voltage: 2.5V; Number of Circuits: 1; Input Bias Current: 2nA; Input Offset Voltage (Vos): 60uV; Operating Supply Current: 2.75mA; Output Current per Channel: 35mA; Voltage Gain: 133.98dB; Power Supply Rejection Ratio (PSRR): 108dB; Supplier 1: Digi-Key; Supplier Part Number 1: LT1677IS8#TRPBFCT-ND; Manufacturer Part Number: LT1677IS8#TRPBF; Stock 1: 4539; Pricing 1: 1 = 5.74000, 25 = 5.12560 (USD); RoHS: Yes; Case/Package: SOIC; Number of Pins: 8; Min Operating Temperature: -40°C; Max Operating Temperature: 85°C; Package Quantity: 2500; Unity Gain Bandwidth Product: 7.2MHz; Nominal Gain Bandwidth Product: 7.2MHz; Packaging: Tape and Reel; Gain Bandwidth Product: 7.2MHz; Number of Elements: 1; Number of Channels: 1; Lead Free: Lead Free; ComponentLink1URL: http://www.linear.com/docs/2102?src-supplier=Digi-Key; ComponentLink1Description: http://www.linear.com/docs/2102?src-supplier=Digi-Key; ComponentLink2URL: http://datasheet.iiic.cc/linear_technology/LT1677IS8_TRPBF.pdf?src-supplier=IIIC; ComponentLink2Description: http://datasheet.iiic.cc/linear_technology/LT1677IS8_TRPBF.pdf?src-supplier=IIIC; Category: Integrated Circuits (ICs)

## Nets that join several sheets
12V: ASB (16 pins), VSU1 (C19_VSU1.2 U3_VSU1.7), VSU2 (C19_VSU2.2 U3_VSU2.7), VSU3 (C19_VSU3.2 U3_VSU3.7)
GND: ASB (45 pins), VSU1 (9 pins), VSU2 (9 pins), VSU3 (9 pins)
OUT: ASB (J7.6R), VSU1 (5 pins)
OUT: ASB (J7.24R), VSU2 (5 pins)
OUT: ASB (J7.34R), VSU3 (5 pins)

## Assembly variants
DNS: not fitted C23 C24 C25 R21 R22 R23